# EAGLE design stm32-rs485-daughter (EAGLE 6.5.0)
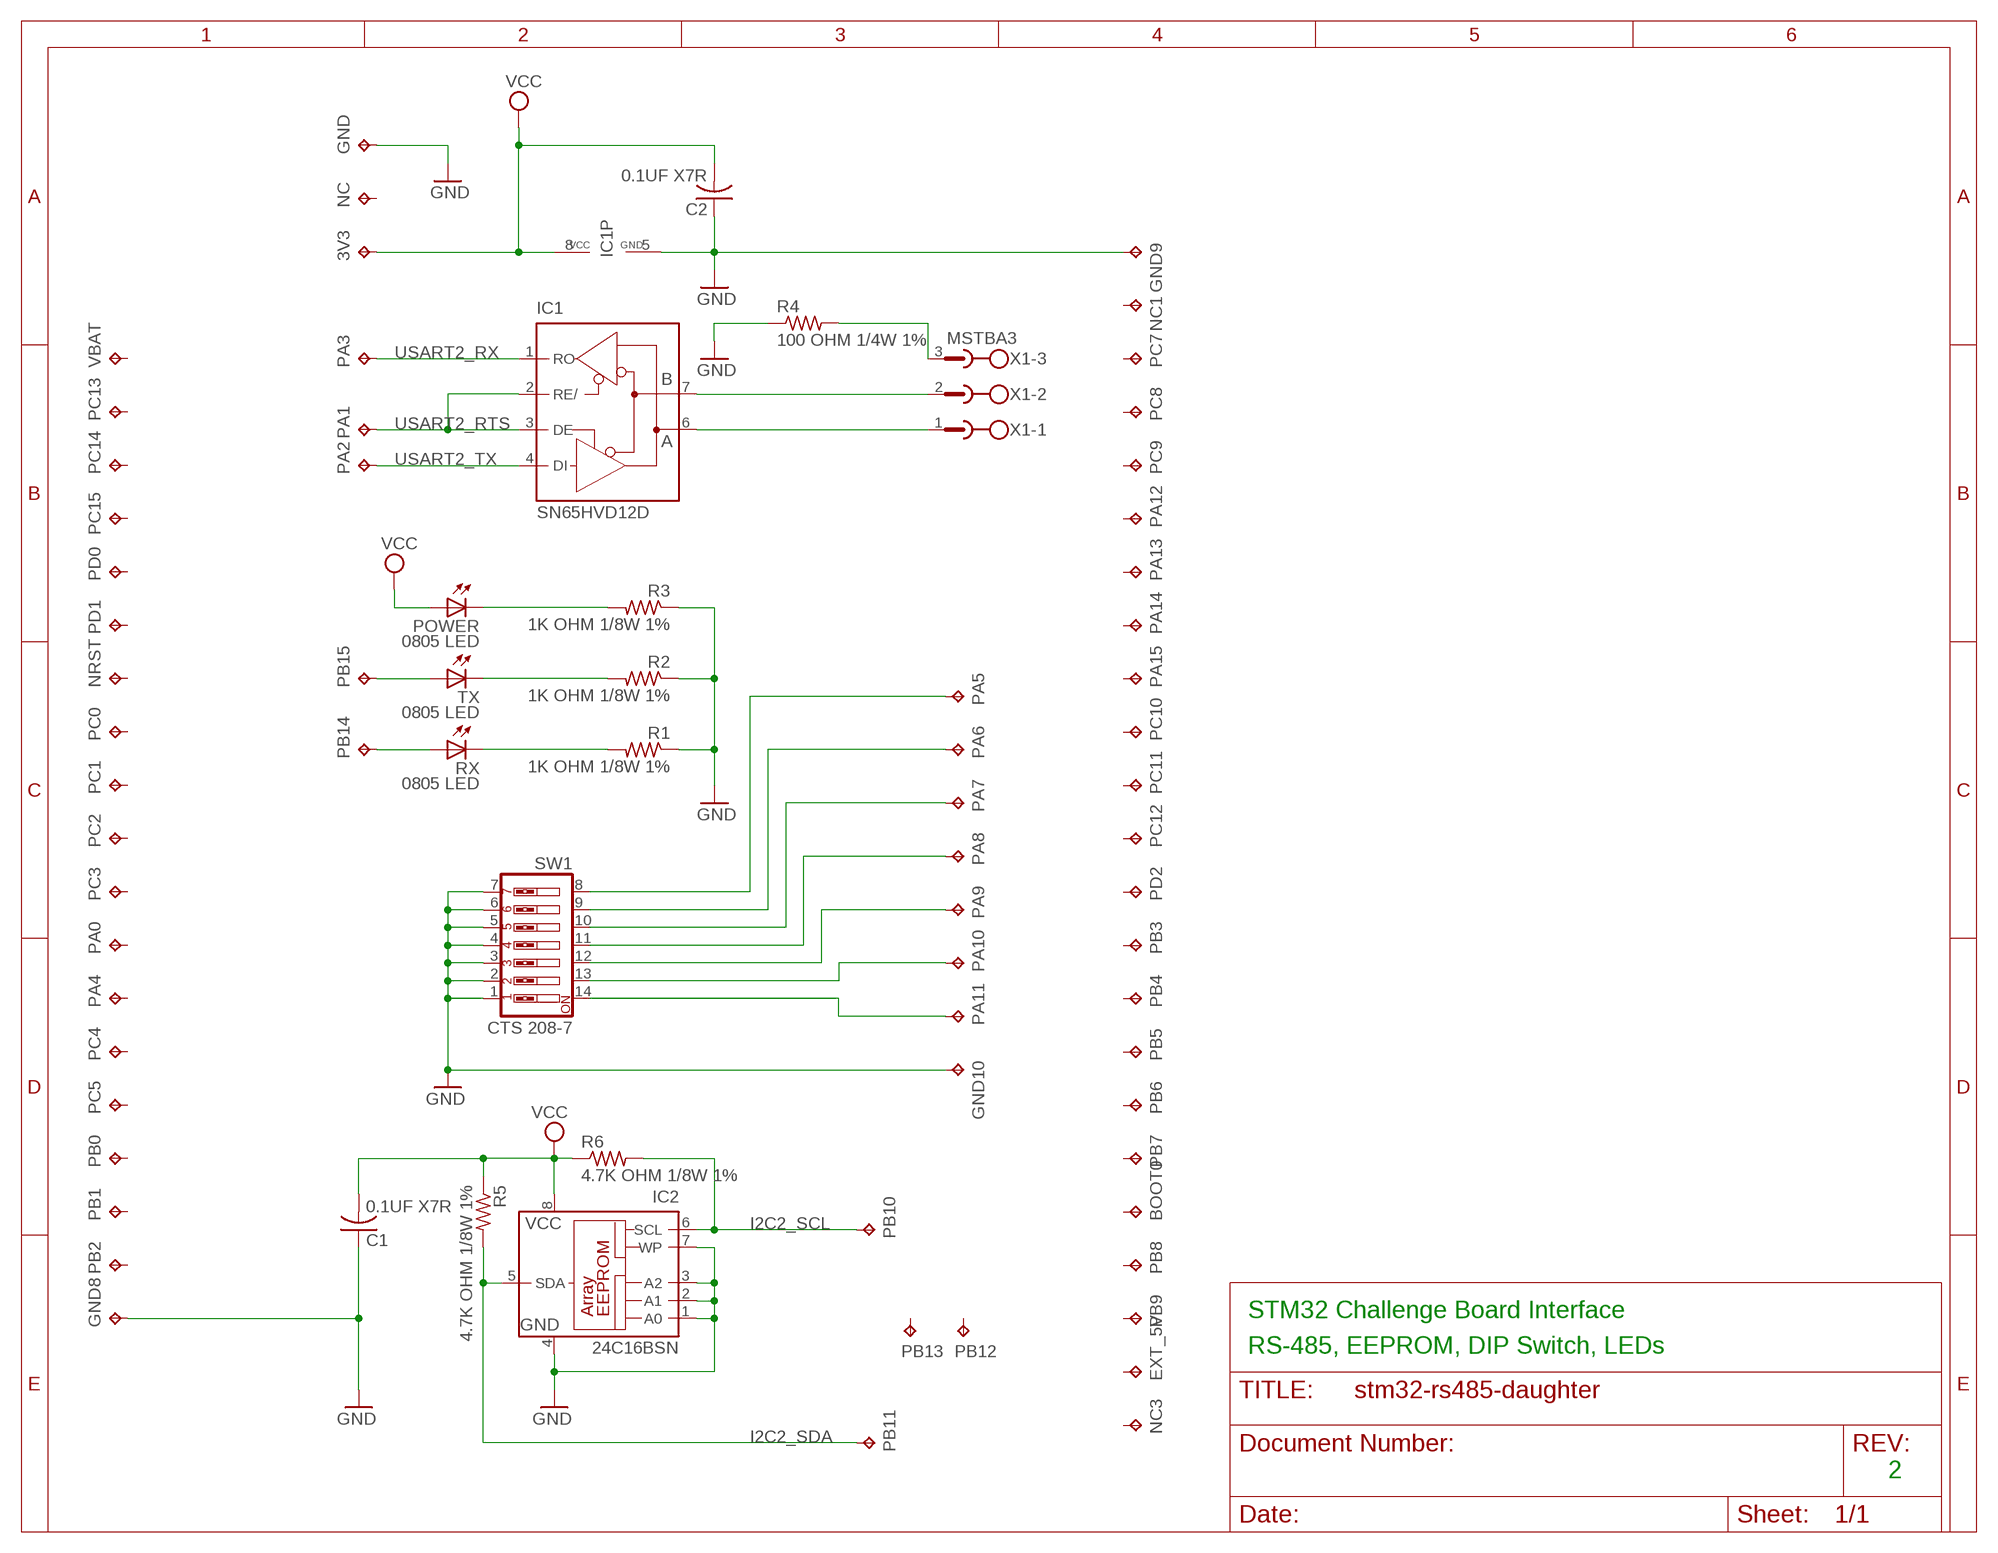
[diagram p0: schematic, sheet 1]

## Parts
3V3  TPPAD1-13  [P1-13]
BOOT0  TPPAD1-13  [P1-13]
C1  0.1UF X7R  C-USC0805  [C0805]
C2  0.1UF X7R  C-USC0805  [C0805]
EXT_5V  TPPAD1-13  [P1-13]
GND  TPPAD1-13  [P1-13]
GND8  TPPAD1-13  [P1-13]
GND9  TPPAD1-13  [P1-13]
GND10  TPPAD1-13  [P1-13]
IC1  SN65HVD12D  MAX481CSA  [SO08]
IC2  24C16BSN  [SO-08]
NC  TPPAD1-13  [P1-13]
NC1  TPPAD1-13  [P1-13]
NC3  TPPAD1-13  [P1-13]
NRST  TPPAD1-13  [P1-13]
PA0  TPPAD1-13  [P1-13]
PA1  TPPAD1-13  [P1-13]
PA2  TPPAD1-13  [P1-13]
PA3  TPPAD1-13  [P1-13]
PA4  TPPAD1-13  [P1-13]
PA5  TPPAD1-13  [P1-13]
PA6  TPPAD1-13  [P1-13]
PA7  TPPAD1-13  [P1-13]
PA8  TPPAD1-13  [P1-13]
PA9  TPPAD1-13  [P1-13]
PA10  TPPAD1-13  [P1-13]
PA11  TPPAD1-13  [P1-13]
PA12  TPPAD1-13  [P1-13]
PA13  TPPAD1-13  [P1-13]
PA14  TPPAD1-13  [P1-13]
PA15  TPPAD1-13  [P1-13]
PB0  TPPAD1-13  [P1-13]
PB1  TPPAD1-13  [P1-13]
PB2  TPPAD1-13  [P1-13]
PB3  TPPAD1-13  [P1-13]
PB4  TPPAD1-13  [P1-13]
PB5  TPPAD1-13  [P1-13]
PB6  TPPAD1-13  [P1-13]
PB7  TPPAD1-13  [P1-13]
PB8  TPPAD1-13  [P1-13]
PB9  TPPAD1-13  [P1-13]
PB10  TPPAD1-13  [P1-13]
PB11  TPPAD1-13  [P1-13]
PB12  TPPAD1-13  [P1-13]
PB13  TPPAD1-13  [P1-13]
PB14  TPPAD1-13  [P1-13]
PB15  TPPAD1-13  [P1-13]
PC0  TPPAD1-13  [P1-13]
PC1  TPPAD1-13  [P1-13]
PC2  TPPAD1-13  [P1-13]
PC3  TPPAD1-13  [P1-13]
PC4  TPPAD1-13  [P1-13]
PC5  TPPAD1-13  [P1-13]
PC7  TPPAD1-13  [P1-13]
PC8  TPPAD1-13  [P1-13]
PC9  TPPAD1-13  [P1-13]
PC10  TPPAD1-13  [P1-13]
PC11  TPPAD1-13  [P1-13]
PC12  TPPAD1-13  [P1-13]
PC13  TPPAD1-13  [P1-13]
PC14  TPPAD1-13  [P1-13]
PC15  TPPAD1-13  [P1-13]
PD0  TPPAD1-13  [P1-13]
PD1  TPPAD1-13  [P1-13]
PD2  TPPAD1-13  [P1-13]
POWER  0805 LED  LEDCHIPLED_0805  [CHIPLED_0805]
R1  1K OHM 1/8W 1%  R-US_R0805  [R0805]
R2  1K OHM 1/8W 1%  R-US_R0805  [R0805]
R3  1K OHM 1/8W 1%  R-US_R0805  [R0805]
R4  100 OHM 1/4W 1%  R-US_R1206  [R1206]
R5  4.7K OHM 1/8W 1%  R-US_R0805  [R0805]
R6  4.7K OHM 1/8W 1%  R-US_R0805  [R0805]
RX  0805 LED  LEDCHIPLED_0805  [CHIPLED_0805]
SW1  CTS 208-7  SW_DIP-7  [EDG-07]
TX  0805 LED  LEDCHIPLED_0805  [CHIPLED_0805]
VBAT  TPPAD1-13  [P1-13]
X1  MSTBA3  [MSTBA3]

## Nets
GND: C1.1 C2.1 GND8.TP GND9.TP GND10.TP GND.TP IC1.5(GND) IC2.1(A0) IC2.2(A1) IC2.3(A2) IC2.4(GND) IC2.7(WP) R1.1 R2.1 R3.1 R4.1 SW1.1 SW1.2 SW1.3 SW1.4 SW1.5 SW1.6 SW1.7
I2C2_SCL: IC2.6(SCL) PB10.TP R6.2
I2C2_SDA: IC2.5(SDA) PB11.TP R5.2
N$1: IC1.7(B) X1.2
N$2: IC1.6(A) X1.1
N$3: R4.2 X1.3
N$5: POWER.C R3.2
N$6: R2.2 TX.C
N$7: R1.2 RX.C
N$11: PB15.TP TX.A
N$12: PB14.TP RX.A
N$13: PA5.TP SW1.8
N$14: PA6.TP SW1.9
N$15: PA7.TP SW1.10
N$16: PA8.TP SW1.11
N$17: PA9.TP SW1.12
N$18: PA10.TP SW1.13
N$19: PA11.TP SW1.14
USART2_RTS: IC1.2(RE/) IC1.3(DE) PA1.TP
USART2_RX: IC1.1(RO) PA3.TP
USART2_TX: IC1.4(DI) PA2.TP
VCC: 3V3.TP C1.2 C2.2 IC1.8(VCC) IC2.8(VCC) POWER.A R5.1 R6.1
Unconnected: BOOT0.TP EXT_5V.TP NC1.TP NC3.TP NC.TP NRST.TP PA0.TP PA4.TP PA12.TP PA13.TP PA14.TP PA15.TP PB0.TP PB1.TP PB2.TP PB3.TP PB4.TP PB5.TP PB6.TP PB7.TP PB8.TP PB9.TP PB12.TP PB13.TP PC0.TP PC1.TP PC2.TP PC3.TP PC4.TP PC5.TP PC7.TP PC8.TP PC9.TP PC10.TP PC11.TP PC12.TP PC13.TP PC14.TP PC15.TP PD0.TP PD1.TP PD2.TP VBAT.TP

## Notes on the sheet
- STM32 Challenge Board Interface
- RS-485, EEPROM, DIP Switch, LEDs
- 2

## Library data of the parts
3V3 BOOT0 EXT_5V GND GND8-GND10 NC NC1 NC3 NRST PA0 PA1-PA15 PB0 PB1-PB15 PC0 PC1-PC5 PC7-PC15 PD0 PD1 PD2 VBAT = testpad:TP: Test pad
C1 C2 = rcl:C-US: CAPACITOR, American symbol
IC1 = maxim:MAX481CSA: RS485 TRANSEIVER
IC2 = microchip:24*: Serial EEPROM I2C
POWER RX TX = led:LED: LED OSRAM: - CHIPLED LG R971, LG N971, LY N971, LG Q971, LY Q971, LO R971, LY R971 LH N974, LH R974 LS Q976, LO Q976, LY Q976 LO Q996 - Hyper CHIPLED LW Q18S LB Q993, LB Q99A, LB R99A - SideLED LS A670, LO A670, LY A670, LG A670, LP A670 LB A673, LV A673, LT A673, LW A673 LH A674 LY A675 LS A676, LA A676, LO A676, LY A676, LW A676 LS A679, LY A679, LG A679 - Hyper Micro SIDELED® LS Y876, LA Y876, LO Y876, LY Y876 LT Y87S - SmartLED LW L88C, LW L88S LB L89C, LB L89S, LG L890 LS L89K, LO L89K, LY L89K LS L896, LA L896, LO L896, LY L896 - TOPLED LS T670, LO T670, LY T670, LG T670, LP T670 LSG T670, LSP T670, LSY T670, LOP T670, LYG T670 LG T671, LOG T671, LSG T671 LB T673, LV T673, LT T673, LW T673 LH T674 LS T676, LA T676, LO T676, LY T676, LB T676, LH T676, LSB T676, LW T676 LB T67C, LV T67C, LT T67C, LS T67K, LO T67K, LY T67K, LW E67C LS E67B, LA E67B, LO E67B, LY E67B, LB E67C, LV E67C, LT E67C LW T67C LS T679, LY T679, LG T679 LS T770, LO T770, LY T770, LG T770, LP T770 LB T773, LV T773, LT T773, LW T773 LH T774 LS E675, LA E675, LY E675, LS T675 LS T776, LA T776, LO T776, LY T776, LB T776 LHGB T686 LT T68C, LB T68C - Hyper Mini TOPLED® LB M676 - Mini TOPLED Santana® LG M470 LS M47K, LO M47K, LY M47K Source: http://www.osram.convergy.de LUXEON: - LUMILED® LXK2-PW12-R00, LXK2-PW12-S00, LXK2-PW14-U00, LXK2-PW14-V00 LXK2-PM12-R00, LXK2-PM12-S00, LXK2-PM14-U00 LXK2-PE12-Q00, LXK2-PE12-R00, LXK2-PE12-S00, LXK2-PE14-T00, LXK2-PE14-U00 LXK2-PB12-K00, LXK2-PB12-L00, LXK2-PB12-M00, LXK2-PB14-N00, LXK2-PB14-P00, LXK2-PB14-Q00 LXK2-PR12-L00, LXK2-PR12-M00, LXK2-PR14-Q00, LXK2-PR14-R00 LXK2-PD12-Q00, LXK2-PD12-R00, LXK2-PD12-S00 LXK2-PH12-R00, LXK2-PH12-S00 LXK2-PL12-P00, LXK2-PL12-Q00, LXK2-PL12-R00 Source: www.luxeon.com KINGBRIGHT: KA-3528ASYC Source: www.kingbright.com
R1-R6 = rcl:R-US_: RESISTOR, American symbol
SW1 = special:SW_DIP-7: DIP SWITCH
X1 = con-phoenix-508:MSTBA3: PHOENIX

## Board
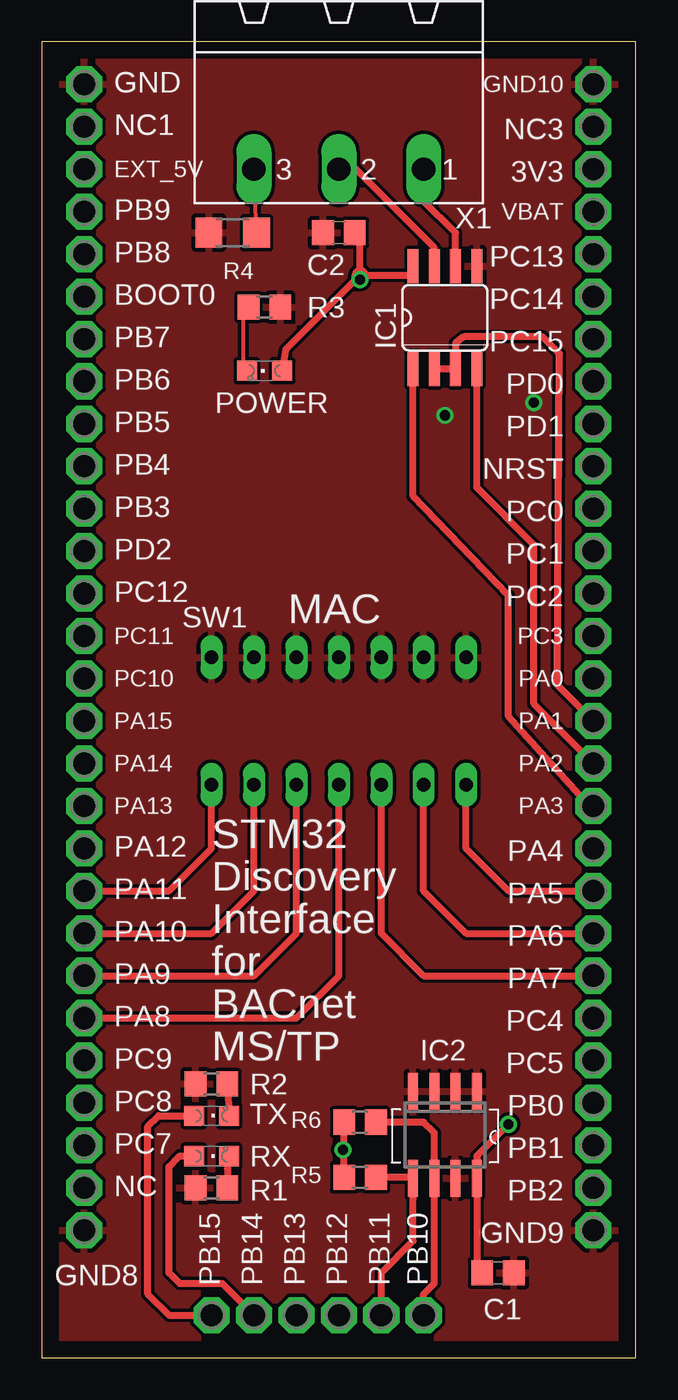
[diagram p1: board, top side]
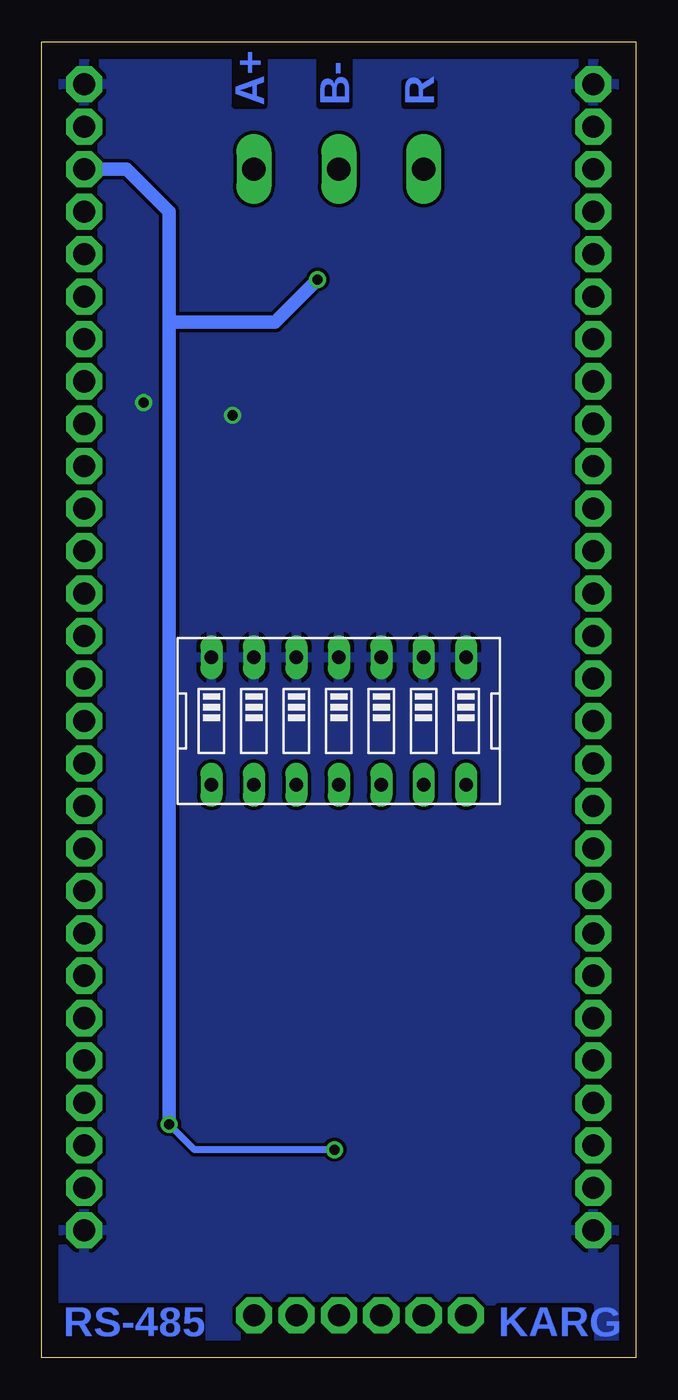
[diagram p2: board, bottom side, seen from below]

Size 35.56 x 78.74 mm. Coordinates in mm from the lower left corner, seen from the top.
Outline: 0,0 35.56,0 35.56,78.74 0,78.74 0,0
Copper layers (1*16): Top_Copper 0.035mm / dielectric 1.5mm / Bottom_Copper 0.035mm
Design rules "default": minimum track width 10mil, minimum drill 24mil, track to track 8mil, track to pad 8mil, pad to pad 8mil, via to via 8mil, smd to smd 8mil, copper to edge 40mil, drill to drill 8mil, minimum pad ring 10mil, minimum via ring 8mil, stop-mask expansion 4mil, vias tented up to drill 0mil, thermal gap 10mil

### Footprints (pad centres in the part's own frame; a part is rotated, then mirrored left to right if it is on the bottom)
P1-13 = drill 1.321 pad 2.159 octagon: TP 0,0
C0805 = smd 1.3 x 1.5: 1 -0.95,0; 2 0.95,0
SO08 = smd 0.66 x 2.032: 1 -1.905,-3.073; 2 -0.635,-3.073; 3 0.635,-3.073; 4 1.905,-3.073; 5 1.905,3.073; 6 0.635,3.073; 7 -0.635,3.073; 8 -1.905,3.073
SO-08 = smd 0.6 x 2.2: 1 -1.905,-2.6; 2 -0.635,-2.6; 3 0.635,-2.6; 4 1.905,-2.6; 5 1.905,2.6; 6 0.635,2.6; 7 -0.635,2.6; 8 -1.905,2.6
CHIPLED_0805 = smd 1.2 x 1.2: A 0,-1.05; C 0,1.05
R0805 = smd 1.3 x 1.5: 1 -0.95,0; 2 0.95,0
R1206 = smd 1.6 x 1.803: 1 -1.422,0; 2 1.422,0
EDG-07 = drill 0.813 long: 1 -7.62,-3.81; 2 -5.08,-3.81; 3 -2.54,-3.81; 4 0,-3.81; 5 2.54,-3.81; 6 5.08,-3.81; 7 7.62,-3.81; 8 7.62,3.81; 9 5.08,3.81; 10 2.54,3.81; 11 0,3.81; 12 -2.54,3.81; 13 -5.08,3.81; 14 -7.62,3.81
MSTBA3 = drill 1.397 long: 1 -5.08,5.08; 2 0,5.08; 3 5.08,5.08

### Placement (x,y rotation side)
3V3  33.02,71.12 0 top
BOOT0  2.54,63.5 0 top
C1  27.3,5.08 180 top
C2  17.78,67.31 0 top
EXT_5V  2.54,71.12 0 top
GND  2.54,76.2 0 top
GND8  2.54,7.62 0 top
GND9  33.02,7.62 0 top
GND10  33.02,76.2 0 top
IC1  24.13,62.23 0 top
IC2  24.13,13.34 180 top
NC  2.54,10.16 0 top
NC1  2.54,73.66 0 top
NC3  33.02,73.66 0 top
NRST  33.02,53.34 0 top
PA0  33.02,40.64 0 top
PA1  33.02,38.1 0 top
PA2  33.02,35.56 0 top
PA3  33.02,33.02 0 top
PA4  33.02,30.48 0 top
PA5  33.02,27.94 0 top
PA6  33.02,25.4 0 top
PA7  33.02,22.86 0 top
PA8  2.54,20.32 0 top
PA9  2.54,22.86 0 top
PA10  2.54,25.4 0 top
PA11  2.54,27.94 0 top
PA12  2.54,30.48 0 top
PA13  2.54,33.02 0 top
PA14  2.54,35.56 0 top
PA15  2.54,38.1 0 top
PB0  33.02,15.24 0 top
PB1  33.02,12.7 0 top
PB2  33.02,10.16 0 top
PB3  2.54,50.8 0 top
PB4  2.54,53.34 0 top
PB5  2.54,55.88 0 top
PB6  2.54,58.42 0 top
PB7  2.54,60.96 0 top
PB8  2.54,66.04 0 top
PB9  2.54,68.58 0 top
PB10  22.86,2.54 0 top
PB11  20.32,2.54 0 top
PB12  17.78,2.54 0 top
PB13  15.24,2.54 0 top
PB14  12.7,2.54 0 top
PB15  10.16,2.54 0 top
PC0  33.02,50.8 0 top
PC1  33.02,48.26 0 top
PC2  33.02,45.72 0 top
PC3  33.02,43.18 0 top
PC4  33.02,20.32 0 top
PC5  33.02,17.78 0 top
PC7  2.54,12.7 0 top
PC8  2.54,15.24 0 top
PC9  2.54,17.78 0 top
PC10  2.54,40.64 0 top
PC11  2.54,43.18 0 top
PC12  2.54,45.72 0 top
PC13  33.02,66.04 0 top
PC14  33.02,63.5 0 top
PC15  33.02,60.96 0 top
PD0  33.02,58.42 0 top
PD1  33.02,55.88 0 top
PD2  2.54,48.26 0 top
POWER  13.34,59.05 90 top
R1  10.16,10.16 0 top
R2  10.16,16.38 0 top
R3  13.34,62.87 180 top
R4  11.43,67.31 0 top
R5  19.05,10.79 0 top
R6  19.05,14.1 0 top
RX  10.16,12.06 270 top
SW1  17.78,38.1 180 bottom
TX  10.16,14.48 270 top
VBAT  33.02,68.58 0 top
X1  17.78,76.2 180 top

### Tracks (layer width: path | path; a pad name or v marks a point on that pad's centre or on a via)
GND  (via drill 0.6)
  other vias: 24.13,56.39 29.46,57.15
  pour Top_Copper: 0,0 0,78.74 35.56,78.74 35.56,0
  pour Bottom_Copper: 0,0 0,78.74 35.56,78.74 35.56,0
I2C2_SCL
  Top_Copper 0.406: PB10.TP 22.86,3.81 23.5,4.45 IC2.6 23.5,13.46 22.86,14.1 R6.2
I2C2_SDA
  Top_Copper 0.406: PB11.TP 20.32,5.08 22.23,6.99 IC2.5 | R5.2 22.16,10.79 IC2.5 | IC2.5 22.23,9.53
N$1
  Top_Copper 0.406: IC1.7 23.5,66.42 18.8,71.12 X1.2
N$2
  Top_Copper 0.406: IC1.6 24.77,67.31 22.86,69.22 X1.1
N$3
  Top_Copper 0.254: R4.2 X1.3
N$5
  Top_Copper 0.254: POWER.C 12.06,59.69 12.06,63.5 R3.2
N$6
  Top_Copper 0.406: TX.C 11.21,15.14 R2.2
N$7
  Top_Copper 0.406: R1.2 11.11,11.33 RX.C
N$11
  Top_Copper 0.406: PB15.TP 7.62,2.54 6.35,3.81 6.35,13.84 6.99,14.48 TX.A
N$12
  Top_Copper 0.406: PB14.TP 10.79,4.45 8.26,4.45 7.62,5.08 7.62,11.43 8.26,12.06 RX.A
N$13
  Top_Copper 0.406: SW1.8 25.4,30.48 27.94,27.94 PA5.TP
N$14
  Top_Copper 0.406: SW1.9 22.86,27.94 25.4,25.4 PA6.TP
N$15
  Top_Copper 0.406: SW1.10 20.32,25.4 22.86,22.86 PA7.TP
N$16
  Top_Copper 0.406: PA8.TP 15.24,20.32 17.78,22.86 SW1.11
N$17
  Top_Copper 0.406: PA9.TP 12.7,22.86 15.24,25.4 SW1.12
N$18
  Top_Copper 0.406: PA10.TP 10.16,25.4 12.7,27.94 SW1.13
N$19
  Top_Copper 0.406: PA11.TP 7.62,27.94 10.16,30.48 SW1.14
USART2_RTS
  Top_Copper 0.406: IC1.2 IC1.3 24.77,60.71 25.27,61.09 29.97,61.09 30.99,60.07 30.86,40.26 PA1.TP
USART2_RX
  Top_Copper 0.406: IC1.1 22.23,51.56 27.94,45.59 27.94,38.35 32.77,33.02 PA3.TP
USART2_TX
  Top_Copper 0.406: IC1.4 26.04,52.07 29.46,48.64 29.46,39.12 PA2.TP
VCC  (via drill 0.6)
  Top_Copper 0.406: 19.05,64.77 19.05,67.31 C2.2 | IC1.8 22.23,64.77 19.05,64.77 | POWER.A 14.61,60.33 19.05,64.77 | C1.2 26.04,5.39 IC2.8 26.04,12.06 v27.94,13.97 | R6.1 18.1,12.51 v18.03,12.45 18.1,12.38 R5.1
  Top_Copper 1.016: v19.05,64.52 19.05,64.77
  Bottom_Copper 0.406: v18.03,12.45 26.42,12.45 v27.94,13.97
  Bottom_Copper 0.813: 3V3.TP 30.48,71.12 27.94,68.58 27.94,61.98 | v27.94,13.97 27.94,61.98 | v19.05,64.52 21.59,61.98 27.94,61.98

### Text on the board
Bottom_Copper: R | B- | A+ | KARG | RS-485
tNames: MAC | STM32 | Discovery | Interface | for | BACnet | MS/TP